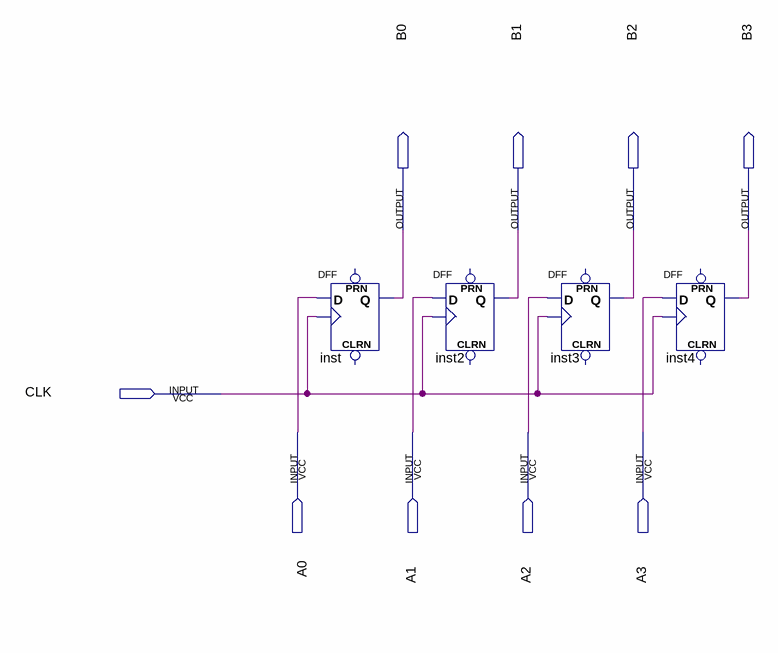
[diagram p0: schematic sheet]
// Quartus schematic registrador_4bit.bdf as structural Verilog: 4 symbols, 9 pins
module registrador_4bit (
  input  CLK,
  input  A0,
  input  A1,
  input  A2,
  input  A3,
  output B0,
  output B1,
  output B2,
  output B3
);

  DFF inst (.CLK(CLK), .D(A0), .Q(B0));  // open: CLRN, PRN
  DFF inst2 (.CLK(CLK), .D(A1), .Q(B1));  // open: CLRN, PRN
  DFF inst3 (.CLK(CLK), .D(A2), .Q(B2));  // open: CLRN, PRN
  DFF inst4 (.CLK(CLK), .D(A3), .Q(B3));  // open: CLRN, PRN
endmodule
